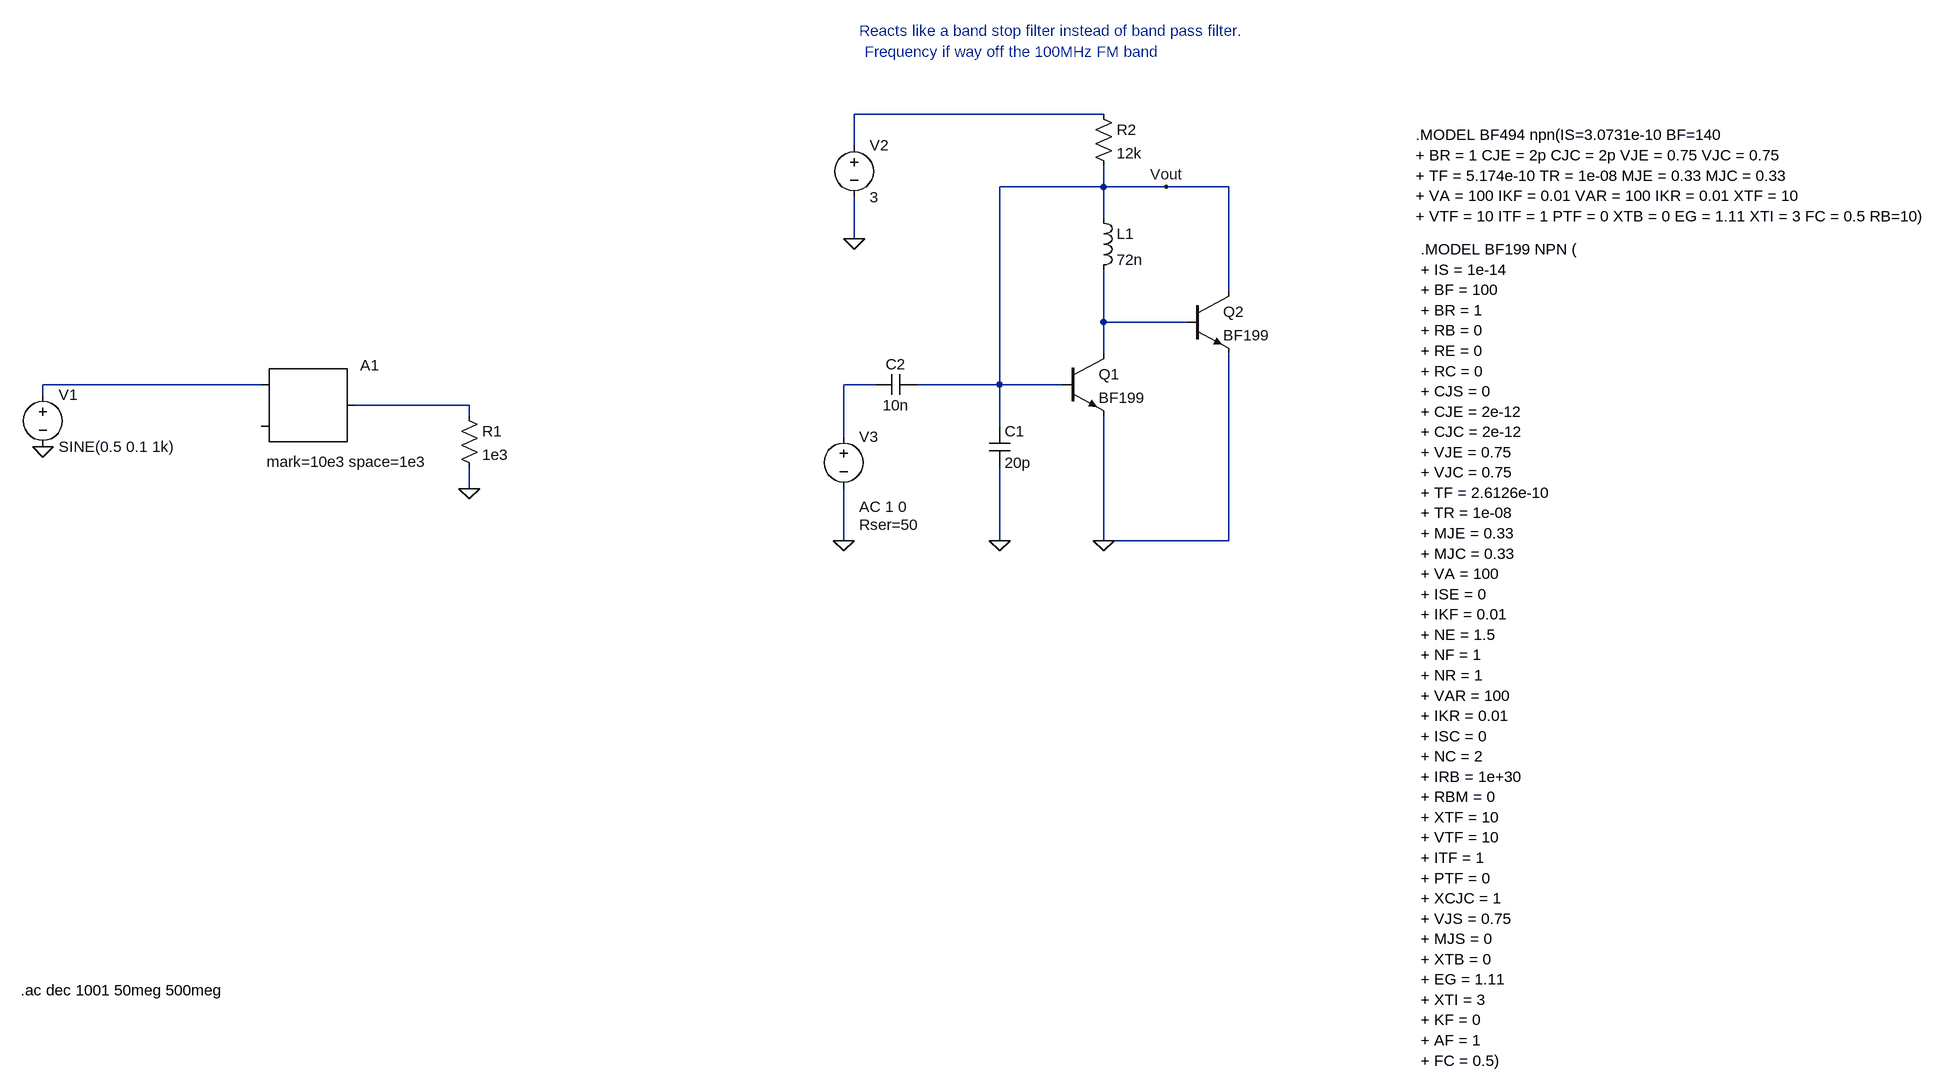
[diagram p0: schematic 1transistor_TRF.asc]
1transistor_TRF.asc, the LTspice schematic file:
Version 4
SHEET 1 4224 1060
WIRE 1360 -304 976 -304
WIRE 976 -256 976 -304
WIRE 1360 -192 1360 -224
WIRE 1360 -192 1200 -192
WIRE 1456 -192 1360 -192
WIRE 1552 -192 1456 -192
WIRE 1360 -144 1360 -192
WIRE 976 -112 976 -176
WIRE 1552 -32 1552 -192
WIRE 1360 16 1360 -64
WIRE 1488 16 1360 16
WIRE 1360 64 1360 16
WIRE 64 112 -272 112
WIRE 1008 112 960 112
WIRE 1200 112 1200 -192
WIRE 1200 112 1072 112
WIRE 1296 112 1200 112
WIRE -272 128 -272 112
WIRE 384 144 208 144
WIRE 384 160 384 144
WIRE 1200 176 1200 112
WIRE 960 192 960 112
WIRE 384 272 384 240
WIRE 960 352 960 272
WIRE 1200 352 1200 240
WIRE 1360 352 1360 160
WIRE 1552 352 1552 64
WIRE 1552 352 1360 352
FLAG -272 208 0
FLAG 384 272 0
FLAG 976 -112 0
FLAG 1200 352 0
FLAG 1360 352 0
FLAG 960 352 0
FLAG 1456 -192 Vout
SYMBOL SpecialFunctions\\modulate 64 112 R0
WINDOW 3 8 119 Left 2
SYMATTR InstName A1
SYMATTR Value mark=10e3 space=1e3
SYMBOL voltage -272 112 R0
WINDOW 123 0 0 Left 0
WINDOW 39 0 0 Left 0
SYMATTR InstName V1
SYMATTR Value SINE(0.5 0.1 1k)
SYMBOL res 368 144 R0
SYMATTR InstName R1
SYMATTR Value 1e3
SYMBOL voltage 976 -272 R0
WINDOW 123 24 44 Left 2
WINDOW 39 0 0 Left 0
SYMATTR InstName V2
SYMATTR Value 3
SYMBOL npn 1296 64 R0
SYMATTR InstName Q1
SYMATTR Value BF199
SYMBOL npn 1488 -32 R0
SYMATTR InstName Q2
SYMATTR Value BF199
SYMBOL cap 1184 176 R0
SYMATTR InstName C1
SYMATTR Value 20p
SYMBOL ind 1344 -160 R0
SYMATTR InstName L1
SYMATTR Value 72n
SYMBOL res 1344 -320 R0
SYMATTR InstName R2
SYMATTR Value 12k
SYMBOL cap 1072 96 R90
WINDOW 0 0 32 VBottom 2
WINDOW 3 32 32 VTop 2
SYMATTR InstName C2
SYMATTR Value 10n
SYMBOL voltage 960 176 R0
WINDOW 123 24 124 Left 2
WINDOW 39 24 152 Left 2
SYMATTR InstName V3
SYMATTR Value ""
SYMATTR Value2 AC 1 0
SYMATTR SpiceLine Rser=50
TEXT 1840 -272 Left 2 !.MODEL BF494 npn(IS=3.0731e-10 BF=140\n+ BR = 1 CJE = 2p CJC = 2p VJE = 0.75 VJC = 0.75\n+ TF = 5.174e-10 TR = 1e-08 MJE = 0.33 MJC = 0.33\n+ VA = 100 IKF = 0.01 VAR = 100 IKR = 0.01 XTF = 10\n+ VTF = 10 ITF = 1 PTF = 0 XTB = 0 EG = 1.11 XTI = 3 FC = 0.5 RB=10)
TEXT 1848 -96 Left 2 !.MODEL BF199 NPN (\n+ IS = 1e-14\n+ BF = 100\n+ BR = 1\n+ RB = 0\n+ RE = 0\n+ RC = 0\n+ CJS = 0\n+ CJE = 2e-12\n+ CJC = 2e-12\n+ VJE = 0.75\n+ VJC = 0.75\n+ TF = 2.6126e-10\n+ TR = 1e-08\n+ MJE = 0.33\n+ MJC = 0.33\n+ VA = 100\n+ ISE = 0\n+ IKF = 0.01\n+ NE = 1.5\n+ NF = 1\n+ NR = 1\n+ VAR = 100\n+ IKR = 0.01\n+ ISC = 0\n+ NC = 2\n+ IRB = 1e+30\n+ RBM = 0\n+ XTF = 10\n+ VTF = 10\n+ ITF = 1\n+ PTF = 0\n+ XCJC = 1\n+ VJS = 0.75\n+ MJS = 0\n+ XTB = 0\n+ EG = 1.11\n+ XTI = 3\n+ KF = 0\n+ AF = 1\n+ FC = 0.5)
TEXT -306 1044 Left 2 !.ac dec 1001 50meg 500meg
TEXT 984 -432 Left 2 ;Reacts like a band stop filter instead of band pass filter.
TEXT 992 -400 Left 2 ;Frequency if way off the 100MHz FM band

The netlist it stands for:
* 1transistor_TRF.asc
A1 N003 0 0 0 0 0 N005 0 MODULATOR mark=10e3 space=1e3
V1 N003 0 SINE(0.5 0.1 1k)
R1 N005 0 1e3
V2 N001 0 3
Q1 N002 Vout 0 0 BF199
Q2 Vout N002 0 0 BF199
C1 Vout 0 20p
L1 Vout N002 72n
R2 N001 Vout 12k
C2 Vout N004 10n
V3 N004 0 AC 1 0 Rser=50
.model NPN NPN
.model PNP PNP
.lib standard.bjt
.MODEL BF494 npn(IS=3.0731e-10 BF=140
+ BR = 1 CJE = 2p CJC = 2p VJE = 0.75 VJC = 0.75
+ TF = 5.174e-10 TR = 1e-08 MJE = 0.33 MJC = 0.33
+ VA = 100 IKF = 0.01 VAR = 100 IKR = 0.01 XTF = 10
+ VTF = 10 ITF = 1 PTF = 0 XTB = 0 EG = 1.11 XTI = 3 FC = 0.5 RB=10)
.MODEL BF199 NPN (
+ IS = 1e-14
+ BF = 100
+ BR = 1
+ RB = 0
+ RE = 0
+ RC = 0
+ CJS = 0
+ CJE = 2e-12
+ CJC = 2e-12
+ VJE = 0.75
+ VJC = 0.75
+ TF = 2.6126e-10
+ TR = 1e-08
+ MJE = 0.33
+ MJC = 0.33
+ VA = 100
+ ISE = 0
+ IKF = 0.01
+ NE = 1.5
+ NF = 1
+ NR = 1
+ VAR = 100
+ IKR = 0.01
+ ISC = 0
+ NC = 2
+ IRB = 1e+30
+ RBM = 0
+ XTF = 10
+ VTF = 10
+ ITF = 1
+ PTF = 0
+ XCJC = 1
+ VJS = 0.75
+ MJS = 0
+ XTB = 0
+ EG = 1.11
+ XTI = 3
+ KF = 0
+ AF = 1
+ FC = 0.5)
.ac dec 1001 50meg 500meg
* Reacts like a band stop filter instead of band pass filter.
* Frequency if way off the 100MHz FM band
.backanno
.end